# EAGLE design weddinginvitation (EAGLE 6.2)
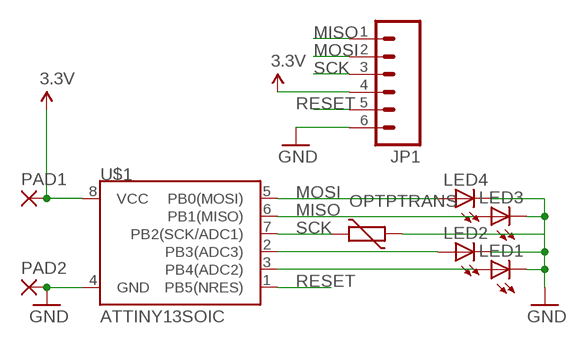
[diagram p0: schematic, sheet 1]

## Parts
JP1  M06SMD-FEMALE-V2  [1X06-SMD-FEMALE-V2]
LED1  LED1206  [LED-1206]
LED2  LED1206  [LED-1206]
LED3  LED1206  [LED-1206]
LED4  LED1206  [LED-1206]
OPTPTRANS  VARISTORCN0805  [CT/CN0805]
PAD1  SMD5  [SMD2,54-5,08]
PAD2  SMD5  [SMD2,54-5,08]
U$1  ATTINY13SOIC  [SO08]

## Nets
3.3V: JP1.4 PAD1.1(P) U$1.8(VCC)
GND: JP1.6 LED1.C LED2.C LED3.C LED4.C OPTPTRANS.1 PAD2.1(P) U$1.4(GND)
MISO: JP1.1 LED3.A U$1.6(PB1(MISO))
MOSI: JP1.2 LED4.A U$1.5(PB0(MOSI))
N$1: LED1.A U$1.3(PB4(ADC2))
N$2: LED2.A U$1.2(PB3(ADC3))
RESET: JP1.5 U$1.1(PB5(NRES))
SCK: JP1.3 OPTPTRANS.2 U$1.7(PB2(SCK/ADC1))

## Library data of the parts
JP1 = SparkFun:M06: Header 6 Standard 6-pin 0.1" header. Use with straight break away headers (SKU : PRT-00116), right angle break away headers (PRT-00553), swiss pins (PRT-00743), machine pins (PRT-00117), and female headers (PRT-00115). Molex polarized connector foot print use with SKU : PRT-08094 with associated crimp pins and housings. NOTES ON THE VARIANTS LOCK and LOCK_LONGPADS... This footprint was designed to help hold the alignment of a through-hole component (i.e. 6-pin header) while soldering it into place. You may notice that each hole has been shifted either up or down by 0.005 of an inch from it's more standard position (which is a perfectly straight line). This slight alteration caused the pins (the squares in the middle) to touch the edges of the holes. Because they are alternating, it causes a "brace" to hold the component in place. 0.005 has proven to be the perfect amount of "off-center" position when using our standard breakaway headers. Although looks a little odd when you look at the bare footprint, once you have a header in there, the alteration is very hard to notice. Also, if you push a header all the way into place, it is covered up entirely on the bottom side. This idea of altering the position of holes to aid alignment will be further integrated into the Sparkfun Library for other footprints. It can help hold any component with 3 or more connection pins.
LED1-LED4 = SparkFun:LED: LEDs Standard schematic elements and footprints for 5mm, 3mm, 1206, and 0603 sized LEDs. 5mm - Spark Fun Electronics SKU : COM-00529 (and others)
OPTPTRANS = varistor:VARISTOR: VARISTOR
PAD1 PAD2 = wirepad:SMD5: SMD PAD
U$1 = SparkFun:ATTINY13

## Net classes
0 default: width 0.381 mm

## Board
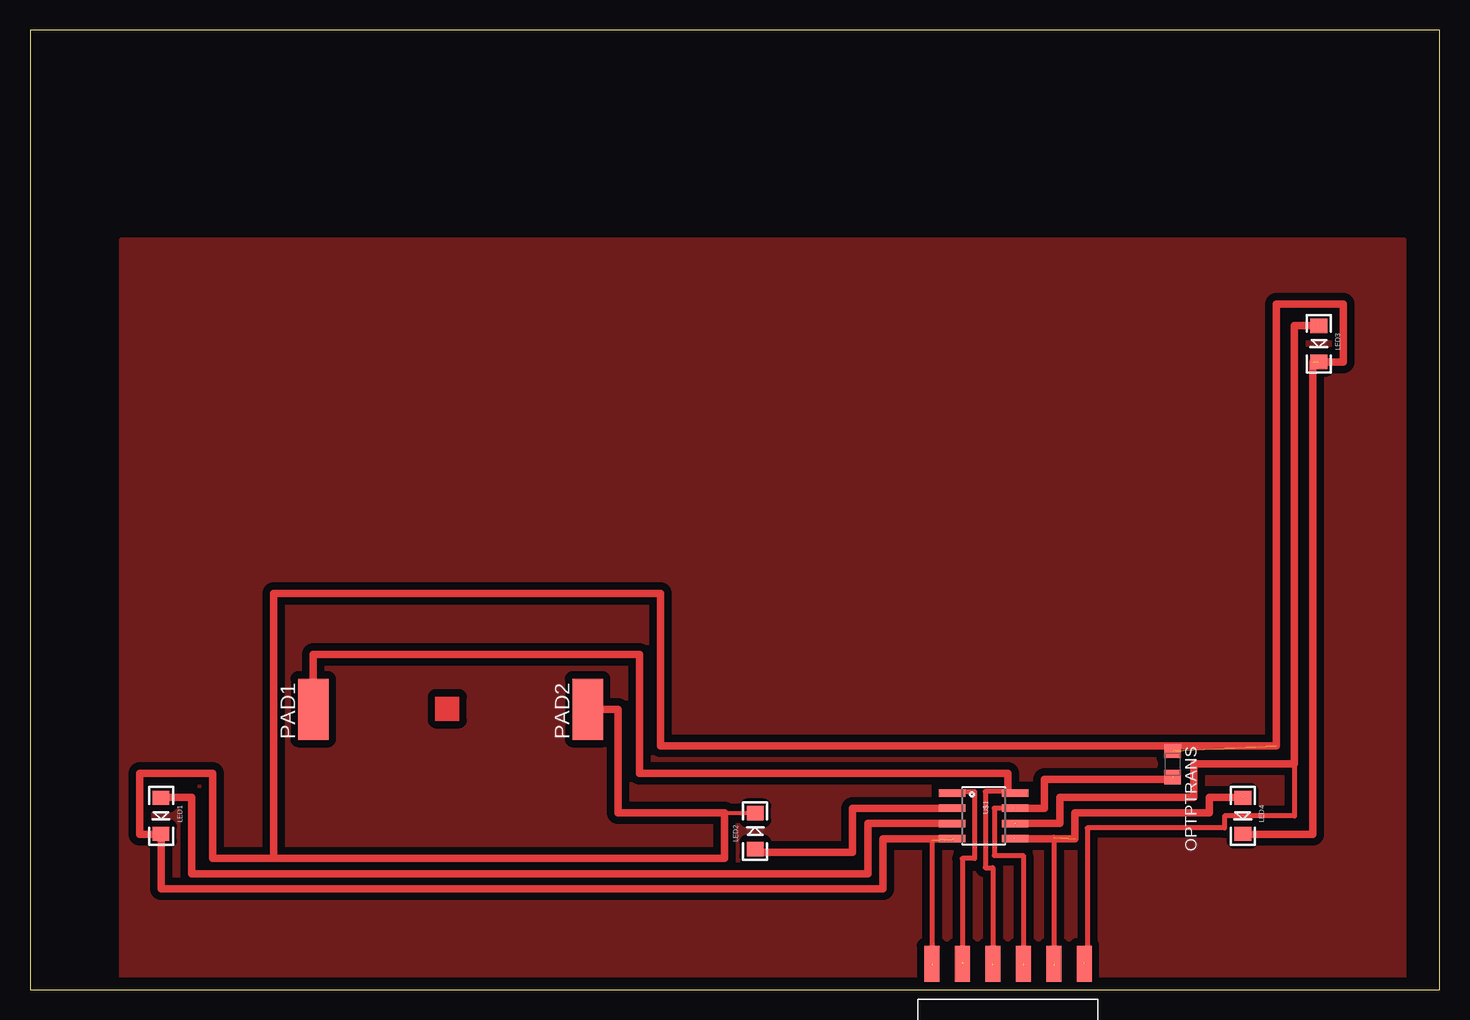
[diagram p1: board, top side]

Size 117.53 x 80 mm. Coordinates in mm from the lower left corner, seen from the top.
Outline: 0,0 117.53,0 117.53,80 0,80 0,0
Copper layers (1*16): Top 0.035mm / dielectric 1.5mm / Bottom 0.035mm
Design rules: minimum track width 10mil, minimum drill 24mil, track to track 25mil, track to pad 30mil, pad to pad 8mil, via to via 8mil, smd to smd 8mil, copper to edge 40mil, drill to drill 8mil, minimum pad ring 10mil, minimum via ring 8mil, stop-mask expansion 4mil, vias tented up to drill 0mil, thermal gap 10mil

### Footprints (pad centres in the part's own frame; a part is rotated, then mirrored left to right if it is on the bottom)
1X06-SMD-FEMALE-V2 = smd 1.25 x 3: 1 6.35,3.425; 2 3.81,3.425; 3 1.27,3.425; 4 -1.27,3.425; 5 -3.81,3.425; 6 -6.35,3.425
LED-1206 = smd 1.2 x 1.4: A -1.5,0; C 1.5,0
CT/CN0805 = smd 1.2 x 1.4: 1 -1.1,0; 2 1.1,0
SMD2,54-5,08 = smd 2.54 x 5.08: 1 0,0
SO08 = smd 0.61 x 2.21: 1 -1.905,-2.616; 2 -0.635,-2.616; 3 0.635,-2.616; 4 1.905,-2.616; 5 1.905,2.616; 6 0.635,2.616; 7 -0.635,2.616; 8 -1.905,2.616

### Placement (x,y rotation side)
JP1  81.53,-1.27 0 top
LED1  10.92,14.48 270 top
LED2  60.45,13.21 90 top
LED3  107.44,53.85 270 top
LED4  101.09,14.48 270 top
OPTPTRANS  95.25,18.8 270 top
PAD1  23.62,23.37 0 top
PAD2  46.48,23.37 0 top
U$1  79.5,14.48 270 top

### Tracks (layer width: path | path; a pad name or v marks a point on that pad's centre or on a via)
3.3V  (1 unrouted)
  Top 0.381: 81.53,16.51 82.04,16.51 U$1.8
  Top 0.406: 81.53,16.51 79.63,16.51 79.63,10.16 80.26,10.16 80.26,2.03
  Top 0.61: PAD1.1 23.62,27.94 50.8,27.94 50.8,18.03 81.53,18.03 81.53,16.51
GND  (5 unrouted)
  Top 0.381: 10.92,12.95 LED1.C | 101.09,12.95 LED4.C | 49.02,14.73 LED2.C | 76.96,12.7 U$1.4
  Top 0.406: 75.18,12.45 75.18,2.03
  Top 0.61: PAD2.1 49.02,23.37 49.02,14.73 57.91,14.73 57.91,10.92 20.32,10.92 | 76.96,12.57 71.12,12.57 71.12,8.38 10.92,8.38 10.92,12.95 9.14,12.95 9.14,18.03 15.24,18.03 15.24,10.92 20.32,10.92 | 101.09,12.95 106.93,12.95 106.93,52.32 109.47,52.32 109.47,57.15 103.89,57.15 103.89,20.32 52.58,20.32 52.58,33.02 20.32,33.02 20.32,10.92
MISO  (3 unrouted)
  Top 0.406: 105.41,18.8 105.41,14.48 99.57,14.48 99.57,13.46 88.14,13.46 88.14,2.29 87.88,2.29
  Top 0.61: 82.17,13.84 85.85,13.84 85.85,16 97.03,16 97.03,18.8 105.41,18.8 105.41,55.37 107.44,55.37
MOSI  (4 unrouted)
  Top 0.381: 82.04,12.45 U$1.5
  Top 0.406: 85.34,12.7 85.34,2.03
  Top 0.61: 82.04,12.57 87.12,12.57 87.12,14.73 98.3,14.73 98.3,16 101.09,16
N$1
  Top 0.381: 10.92,16 LED1.A | 76.71,13.84 U$1.3
  Top 0.61: 77.09,13.84 76.71,13.84 69.85,13.84 69.85,9.65 13.46,9.65 13.46,16 10.92,16
N$2
  Top 0.381: 60.45,11.43 LED2.A | 76.71,15.11 U$1.2
  Top 0.61: 60.45,11.43 68.58,11.43 68.58,15.11 76.71,15.11 77.09,15.11
N$3
  pour Top: 7.62,-0.51 114.55,-0.51 114.55,62.48 7.62,62.48
RESET  (1 unrouted)
  Top 0.381: 76.96,16.51 U$1.1
  Top 0.406: 76.96,16.51 78.74,16.51 78.74,10.92 77.72,10.92 77.72,2.29
SCK  (3 unrouted)
  Top 0.406: 82.04,15.11 80.39,15.11 80.39,11.18 82.8,11.18 82.8,2.03
  Top 0.61: 82.04,15.11 84.58,15.11 84.58,17.53 95.25,17.53 95.25,17.78
(copper drawn outside any net)
  shapes: Top area x1